# Altium schematic sheet MCU.SchDoc
size A; SheetNumber: 2; SheetTotal: 3
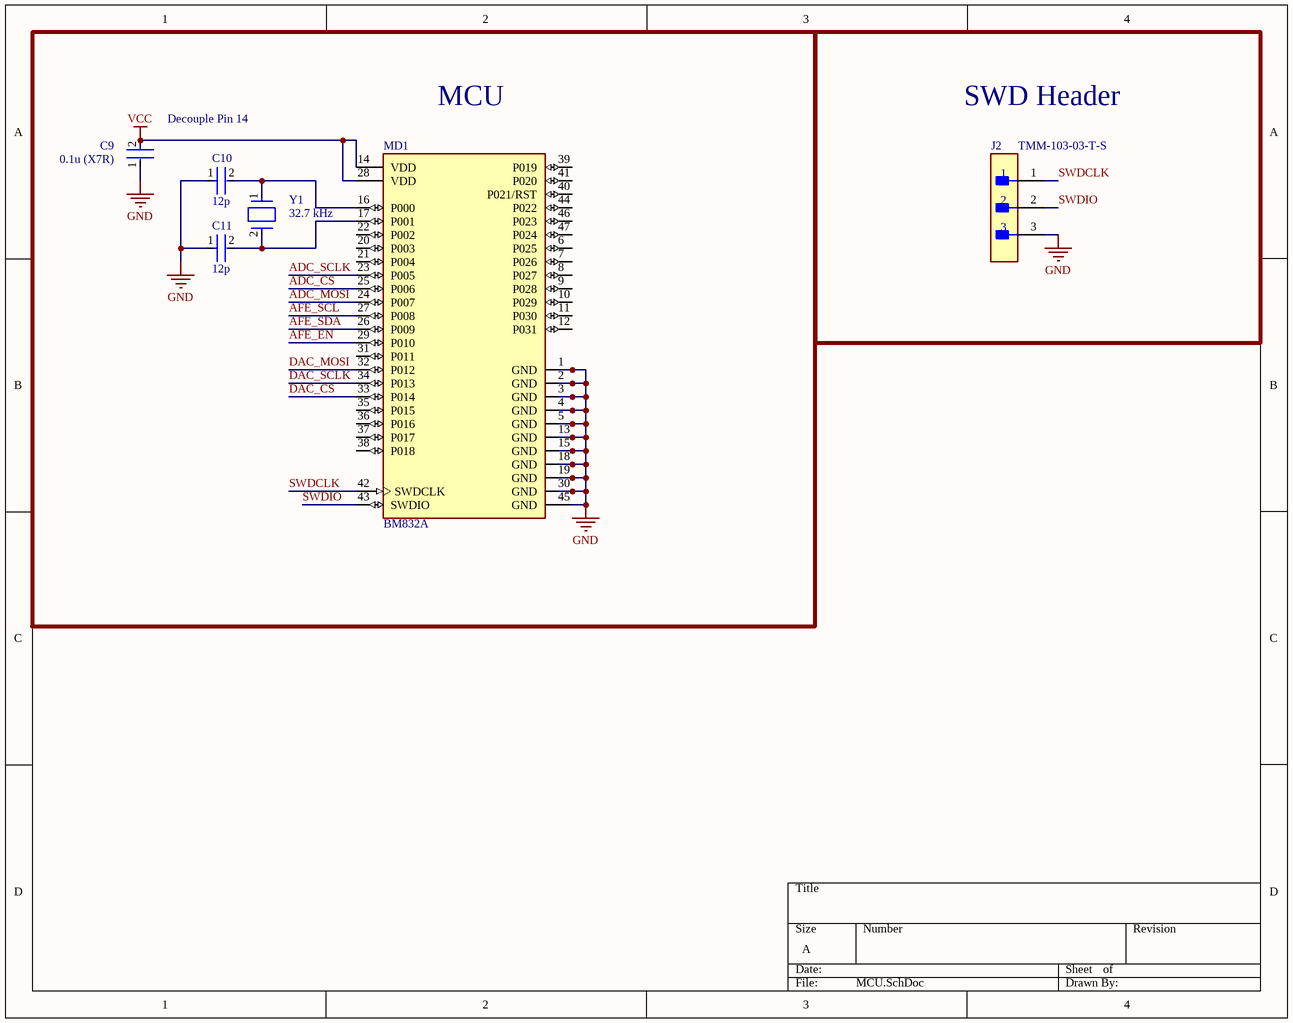
[diagram p0: MCU.SchDoc]

## Parts
C9  0.1u (X7R)  [FP-GCJ188-0_2-IPC_C]
C10  12p  [FP-GCM188-0_1-IPC_B]
C11  12p  [FP-GCM188-0_1-IPC_B]
J2  TMM-103-03-T-S  [FP-TMM-103-03-T-S-MFG]
MD1  BM832A  [FP-BM832A-MFG]
Y1  32.7 kHz  [FP-ECS-CDX-MFG]

## Blocks framed on the sheet
MCU: C9-C11 MD1 Y1
SWD Header: J2

## Nets
GND: C9.1 C10.1 C11.1 J2.3 MD1.1(GND) MD1.2(GND) MD1.3(GND) MD1.4(GND) MD1.5(GND) MD1.13(GND) MD1.15(GND) MD1.18(GND) MD1.19(GND) MD1.30(GND) MD1.45(GND)
VCC: C9.2 MD1.14(VDD) MD1.28(VDD)
ADC_CS: MD1.25(P006)
ADC_MOSI: MD1.24(P007)
ADC_SCLK: MD1.23(P005)
AFE_EN: MD1.29(P010)
AFE_SCL: MD1.27(P008)
AFE_SDA: MD1.26(P009)
DAC_CS: MD1.33(P014)
DAC_MOSI: MD1.32(P012)
DAC_SCLK: MD1.34(P013)
SWDCLK: J2.1 MD1.42(SWDCLK)
SWDIO: J2.2 MD1.43(SWDIO)
NetC10_2: C10.2 MD1.16(P000) Y1.1(In/Out)
NetC11_2: C11.2 MD1.17(P001) Y1.2(Out/In)

Not connected (* = marked no-connect by the designer): MD1 6(P025) 7(P026) 8(P027) 9(P028) 10(P029) 11(P030) 12(P031) 20(P003) 21(P004) 22(P002) 31(P011) 35(P015) 36(P016) 37(P017) 38(P018) 39(P019) 40(P021/RST) 41(P020) 44(P022) 46(P023) 47(P024)

## Notes on the sheet
- Decouple Pin 14

## Library data of the parts
C9 = CMP-2006-02223-2: Cap Ceramic 0.1uF 50V X7R 10% Pad SMD 0603 Soft Termination +125°C Automotive T/R; Capacitance: 100nF; Radiation Hardening: No; Dielectric: X7R; Voltage Rating (DC): 50V; Case Code (Imperial): 0603; Length: 1.6mm; Features: Soft Termination; Case Code (Metric): 1608; Case/Package: 0603; Termination: SMD/SMT; Packaging: Tape and Reel; Height: 0.8mm; Tolerance: 10%; Thickness: 0.035inch; Width: 0.031inch; Voltage Rating: 50V; Min Operating Temperature: -55°C; Ratings: AEC-Q200; Package Quantity: 1; Depth: 0.8mm; Mount: Surface Mount; Lead Free: Lead Free; Max Operating Temperature: 125°C
C10 C11 = CMP-06035-018127-1: Ceramic Capacitor for Automotive 12pF  ±1% 100VDC C0G 0603 Paper T/R
J2 = CMP-02766-001695-1: CONN HEADER VERT 3POS 2MM; Gender: Male; Number of Positions: 3; Max Current Rating: 3.9A; Max Voltage Rating (AC): 500V; Packaging: Bulk; RoHS Compliant: Yes; Mount: Through Hole; Length: 6mm; Contact Type: Male Pin; Package Quantity: 1; Depth: 1.97mm; Contact Material: Bronze; Insulation Material: Polymer; Series: TMM; Contact Plating: Tin; Fastening Type: Pull; Housing Color: Black; Pitch: 2mm; Termination: Solder; Contact Mating Length: 0.157inch; Min Operating Temperature: -55°C; REACH SVHC: No SVHC; Orientation: Straight; Number of Rows: 1; Color: Black; Insulation Color: Black; Connector Type: Header; Radiation Hardening: No; Number of Contacts: 3; Lead Free: Lead Free; Contact Finish - Mating: TIN; Max Operating Temperature: 105°C; Housing Material: Polymer; Contact Shape: Square
MD1 = CMP-216577-000005-1: RX TXRX MODULE BT PCB TRC SMD; Sensitivity: -96dBm; Interface: I2C; Frequency: 2.4GHz; Data Rate: 1Mbps; Memory Size: 24KB; Series: -; Case/Package: SMD/SMT; Mount: Surface Mount; Min Operating Temperature: -40°C; Max Operating Temperature: 85°C
Y1 = CMP-40224-000016-1: CRYSTAL 32.7680KHZ 12.5PF SMD; ESR (Equivalent Series Resistance): 70kR; Frequency: 32.768kHz; Frequency Tolerance: 5ppm; Load Capacitance: 12.5pF; Packaging: Tape and Reel; Case/Package: SMD/SMT; Min Operating Temperature: -40°C; Max Operating Temperature: 85°C; Mount: Surface Mount